# EasyEDA Pro project MAX5864_REUSE.eprj, board PCB3_1
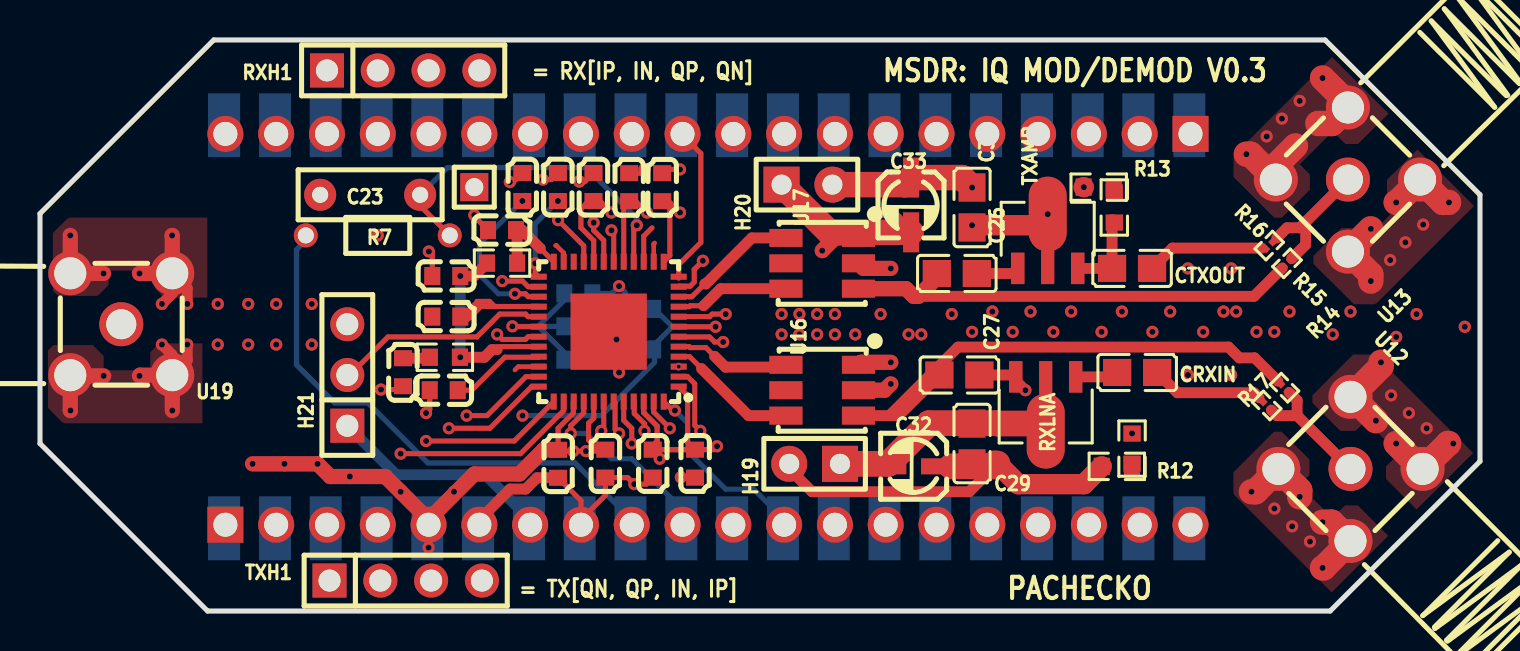
[diagram p12: board, top side]
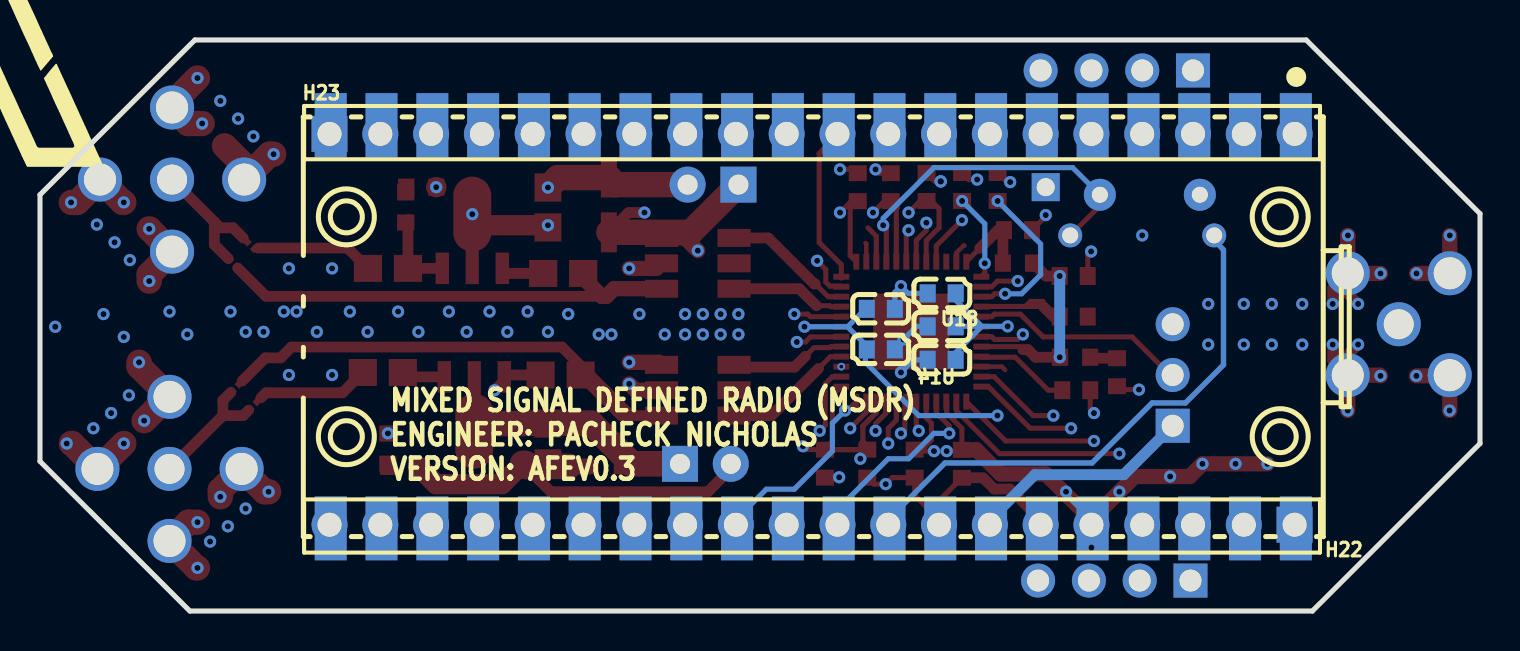
[diagram p13: board, bottom side, seen from below]

Outline 72.01 x 28.58 mm; copper layers: Top Layer, GND, Inner1, Inner2, 3.3, Bottom Layer. Coordinates in mm from the lower left corner of the outline.
Outline path: 0,19.89 0,8.38 8.38,0 64.52,0 72.01,7.49 72.01,20.83 64.26,28.58 8.69,28.58 0,19.89
Stack: Top Layer 0.035mm 外层铜厚1oz / Dielectric1 0.0994mm 3313 RC57% 4.2mil / GND 0.0152mm 内层铜厚 / Dielectric2 0.55mm 0.55mm H/H不含铜 / Inner1 0.0152mm 内层铜厚 / Dielectric3 0.1088mm 2116 RC54% 4.9mil / Inner2 0.0152mm 内层铜厚 / Dielectric4 0.55mm 0.55mm H/H不含铜 / 3.3 0.0152mm 内层铜厚 / Dielectric5 0.0994mm 3313 RC57% 4.2mil / Bottom Layer 0.035mm 外层铜厚1oz

## Design rules (mm)
net RXQN: RXQ
net RXQP: RXQ
net RXIN: RXI
net RXIP: RXI
net TXQN: TXQ
net TXQP: TXQ
net TXIN: TXI
net TXIP: TXI
net RXP: RX
net RXN: RX
net TXP: TX
net TXN: TX
template: Custom Config
spacing copperThickness1oz (default): track to track 0.102, other pairs 0.152 to 0.3
spacing copperThickness2oz: track to track 0.203, other pairs 0.152 to 0.3
track width copperThickness1oz (default): min 0.127, default 0.254, max 2.54
track width copperThickness2oz: min 0.203, default 0.254, max 2.54
differential pair differentialPair (default): width min 0.127, default 0.254, max 2.54; gap min 0.152, default 0.152
via viaSize (default): diameter min 0.356, default 0.61, max 10; hole min 0.198, default 0.305, max 6.3
region e1572 uses copperRegion, innerPlane

## Placement (name value [footprint] x y rotation side)
C18  100nF  [C0603]  20.19 11.05 0 top
C19  100nF  [C0603]  20.32 14.73 0 top
C20  100pF  [C0603]  23.11 19.06 0 top
C21  2200pF  [C0603]  18.15 11.95 90 top
C22  68pF  [C0603]  20.32 16.76 0 top
C23  470nF  [CAP-TH_L7.2-W2.5-P5.00-D0.5]  16.51 20.83 0 top
C26  22nF  [C0805]  45.85 16.89 0 top
C27  22nF  [C0805]  45.97 11.81 0 top
C29  100nF  [C0805]  46.61 8.38 90 top
C31  100nF  [C0805]  46.61 20.19 270 top
C32  100uF  [CAP-SMD_BD3.0-L3.3-W3.3-RD]  43.69 7.24 0 top
C33  100uF  [CAP-SMD_BD3.0-L3.3-W3.3-RD]  43.56 20.32 90 top
CLNA  100pF  [C0603]  32.76 7.38 270 top
CPA  100nF  [C0603]  31.11 21.21 90 top
CPA1  10uF  [C0603]  29.96 15.12 180 bottom
CPA2  10uF  [C0603]  29.96 13.09 180 bottom
CPLL  100pF  [C0603]  27.68 21.22 90 top
CRXIN  22nF  [C0805]  54.86 11.94 0 top
CRXMX  100pF  [C0603]  30.64 7.38 270 top
CTXMX  100pF  [C0603]  29.46 21.21 90 top
CTXOUT  22nF  [C0805]  54.61 17.15 0 top
CVCCCP  10nF  [C0603]  25.9 21.22 90 top
CVCO0  100pF  [C0603]  26.92 15.9 0 bottom
CVCO1  100pF  [C0603]  26.92 14.25 0 bottom
CVCO2  100pF  [C0603]  26.92 12.57 0 bottom
CVRXA  100pF  [C0603]  25.91 7.37 270 top
CVRXF  100pF  [C0603]  28.27 7.38 270 top
CVXTAL  100pF  [C0603]  24.12 21.22 90 top
H12  -  [HDR-TH_1P-V-M_XKB_X4611WV-01I-C28D40]  21.72 21.21 180 top
H19  -  [HDR-TH_2P-P2.54-V-M-1]  38.73 7.37 180 top
H20  -  [HDR-TH_2P-P2.54-V-M-1]  38.35 21.34 0 top
H21  -  [HDR-TH_3P-P2.54-V-M]  15.37 11.81 90 top
H22  -  [HDR-TH_20P-P2.54-V-M-1]  33.4 4.32 0 bottom
H23  -  [HDR-TH_20P-P2.54-V-M-1]  33.4 23.88 180 bottom
R5  1.2k  [R0603]  20.25 12.7 0 top
R6  750  [R0603]  23.11 17.41 180 top
R7  10kΩ  [RES-TH_BD1.8-L3.2-P7.20-D0.4]  16.89 18.8 0 top
R10  10K  [R0603]  54.61 8.13 270 top
R11  10K  [R0603]  53.72 20.19 90 top
R12  150 @ 12v  [R0603]  53.85 7.24 180 top
R13  150 @ 12v  [R0603]  52.94 21.21 180 top
R14  10K  [R0201]  62.23 11.18 135 top
R15  10K  [R0201]  62.36 17.4 225 top
R16  10K  [R0201]  61.47 18.29 225 top
R17  10K  [R0201]  61.34 10.29 135 top
RXH1  -  [HDR-TH_4P-P2.54-V-M]  18.16 27.05 0 top
RXLNA  GALI-S66+  [SOT-89-3_L4.5-W2.5-P1.50-LS4.2-BR]  50.29 10.36 90 top
TXAMP  GALI-52+  [SOT-89-3_L4.5-W2.5-P1.50-LS4.2-BR]  50.39 18.5 270 top
TXH1  -  [HDR-TH_4P-P2.54-V-M]  18.29 1.52 0 top
U12  MCX5.08-H5  [SMA-TH_MCX5.08-H5]  65.53 7.11 315 top
U13  MCX5.08-H5  [SMA-TH_MCX5.08-H5]  65.41 21.59 45 top
U14  MAX2831ETM+T  [TQFN-48_L7.0-W7.0-P0.50-TL-EP5.6]  28.44 13.98 180 top
U16  TCM2-43X+  [IND-SMD_6P-L4.1-W3.8-P1.27-TL]  39.12 11.05 270 top
U17  TCM2-43X+  [IND-SMD_6P-L4.1-W3.8-P1.27-TL]  39.12 17.4 270 top
U18  PICO  [COMM-SMD_L51.0-W21.0-P2.54_SC0916]  33.66 14.22 0 bottom
U19  MCX5.08-H5  [SMA-TH_MCX5.08-H5]  4.06 14.35 180 top

## Footprints (pads in the part's own frame, mm; a bottom-side part is the same pattern mirrored in y, then rotated)
C0603
  rect 0.8x0.9 smd: 1(-0.7,0) 2(0.7,0)
C0805
  rect 1.41x1.35 smd: 1(-1,0) 2(1,0)
CAP-SMD_BD3.0-L3.3-W3.3-RD
  rect 2x0.8 smd: 1(1.37,0) 2(-1.37,0)
CAP-TH_L7.2-W2.5-P5.00-D0.5
  round 1.6 hole 0.8: 1(-2.5,0) 2(2.5,0)
COMM-SMD_L51.0-W21.0-P2.54_SC0916
  rect 1.6x3.2 smd: 1(-24.445,-10.088) 2(-21.905,-10.088) 3(-19.365,-10.088) 4(-16.825,-10.088) 5(-14.285,-10.088) 6(-11.745,-10.088) 7(-9.205,-10.088) 8(-6.665,-10.088) 9(-4.125,-10.088) 10(-1.585,-10.088) 11(0.955,-10.088) 12(3.495,-10.088) 13(6.035,-10.088) 14(8.575,-10.088) 15(11.115,-10.088) 16(13.655,-10.088) 17(16.195,-10.088) 18(18.735,-10.088) 19(21.275,-10.088) 20(23.815,-10.088) 21(23.815,10.088) 22(21.275,10.088) 23(18.735,10.088) 24(16.195,10.088) 25(13.655,10.088) 26(11.115,10.088) 27(8.575,10.088) 28(6.035,10.088) 29(3.495,10.088) 30(0.955,10.088) 31(-1.585,10.088) 32(-4.125,10.088) 33(-6.665,10.088) 34(-9.205,10.088) 35(-11.745,10.088) 36(-14.285,10.088) 37(-16.825,10.088) 38(-19.365,10.088) 39(-21.905,10.088) 40(-24.445,10.088)
HDR-TH_1P-V-M_XKB_X4611WV-01I-C28D40
  rect 1.4x1.4 hole 0.9: 1(0,0)
HDR-TH_2P-P2.54-V-M-1
  rect 1.8x1.8 hole 1: 1(-1.27,0)
  round 1.8 hole 1: 2(1.27,0)
HDR-TH_3P-P2.54-V-M
  rect 1.7x1.7 hole 1.1: 1(-2.54,0)
  round 1.7 hole 1.1: 2(0,0) 3(2.54,0)
HDR-TH_4P-P2.54-V-M
  rect 1.7x1.7 hole 1.1: 1(-3.81,0)
  round 1.7 hole 1.1: 2(-1.27,0) 3(1.27,0) 4(3.81,0)
HDR-TH_20P-P2.54-V-M-1
  rect 1.8x1.8 hole 1.2: 1(-24.13,0)
  round 1.8 hole 1.2: 2(-21.59,0) 3(-19.05,0) 4(-16.51,0) 5(-13.97,0) 6(-11.43,0) 7(-8.89,0) 8(-6.35,0) 9(-3.81,0) 10(-1.27,0) 11(1.27,0) 12(3.81,0) 13(6.35,0) 14(8.89,0) 15(11.43,0) 16(13.97,0) 17(16.51,0) 18(19.05,0) 19(21.59,0) 20(24.13,0)
IND-SMD_6P-L4.1-W3.8-P1.27-TL
  rect 0.9x1.657 smd: 1(-1.27,1.813) 2(0,1.813) 3(1.27,1.813) 4(1.27,-1.813) 5(0,-1.813) 6(-1.27,-1.813)
R0201
  rect 0.303x0.324 smd: 1(-0.241,0) 2(0.241,0)
R0603
  rect 0.806x0.864 smd: 1(-0.753,0) 2(0.753,0)
RES-TH_BD1.8-L3.2-P7.20-D0.4
  round 1.2 hole 0.8: 1(-3.6,0) 2(3.6,0)
SMA-TH_MCX5.08-H5
  round 2.2 hole 1.6: 1(-2.55,-2.55) 2(-2.55,2.55) 3(2.55,2.55) 4(2.55,-2.55)
  round 2.2 hole 1.5: 5(0,0)
SOT-89-3_L4.5-W2.5-P1.50-LS4.2-BR
  rect 1.575x0.672 smd: 1(1.356,-1.5) 3(1.356,1.5)
  custom 5.377x1.9 smd: 2(-1.356,0)
TQFN-48_L7.0-W7.0-P0.50-TL-EP5.6
  rect 0.8x0.3 smd: 1(-3.5,2.751) 2(-3.5,2.251) 3(-3.5,1.75) 4(-3.5,1.251) 5(-3.5,0.75) 6(-3.5,0.252) 7(-3.5,-0.249) 8(-3.5,-0.75) 9(-3.5,-1.25) 10(-3.5,-1.75) 11(-3.5,-2.249) 12(-3.5,-2.748) 25(3.5,-2.748) 26(3.5,-2.249) 27(3.5,-1.75) 28(3.5,-1.25) 29(3.5,-0.75) 30(3.5,-0.249) 31(3.5,0.252) 32(3.5,0.75) 33(3.5,1.251) 34(3.5,1.75) 35(3.5,2.251) 36(3.5,2.751)
  rect 0.3x0.8 smd: 13(-2.751,-3.5) 14(-2.251,-3.5) 15(-1.75,-3.5) 16(-1.25,-3.5) 17(-0.75,-3.5) 18(-0.251,-3.5) 19(0.249,-3.5) 20(0.75,-3.5) 21(1.25,-3.5) 22(1.75,-3.5) 23(2.251,-3.5) 24(2.751,-3.5) 37(2.751,3.5) 38(2.251,3.5) 39(1.75,3.5) 40(1.25,3.5) 41(0.75,3.5) 42(0.251,3.5) 43(-0.251,3.5) 44(-0.75,3.5) 45(-1.25,3.5) 46(-1.75,3.5) 47(-2.251,3.5) 48(-2.751,3.5)
  rect 3.81x3.81 smd: 49(0,0.001)

## Nets
GND: C18.1 C20.1 C21.1 C22.1 C23.1 C29.2 C31.2 C32.2 C33.2 CLNA.2 CPA.2 CPA1.2 CPA2.2 CPLL.2 CRXMX.2 CTXMX.2 CVCCCP.2 CVCO0.2 CVCO1.2 CVCO2.2 CVRXA.2 CVRXF.2 CVXTAL.2 H19.1 H20.1 H22.3 H22.6 H22.8 H22.13 H22.18 H23.3 H23.8 H23.13 H23.18 RXLNA.2 TXAMP.2 U12.1 U12.2 U12.3 U12.4 U13.1 U13.2 U13.3 U13.4 U14.2 U14.26 U14.31 U14.47 U16.1 U16.2 U17.1 U17.2 U18.3 U18.8 U18.13 U18.18 U18.23 U18.28 U18.33 U18.35 U18.38 U19.1 U19.2 U19.3 U19.4
VCC: C29.1 C32.1 H19.2 R12.2
VCC2: C31.1 C33.1 H20.2 R13.2
3.3: CLNA.1 CPA.1 CPA1.1 CPA2.1 CPLL.1 CRXMX.1 CTXMX.1 CVCCCP.1 CVCO0.1 CVCO1.1 CVCO2.1 CVRXA.1 CVRXF.1 CVXTAL.1 H22.5 U14.1 U14.7 U14.13 U14.17 U14.20 U14.25 U14.27 U14.30 U14.39 U14.41 U14.46 U18.36
BYPASS: C18.2 U14.33
CLK: H21.1 H22.7 U18.34
CPOUT: C20.2 R6.1 U14.24
CS#: H22.19 U14.15 U18.22
CTUNE: H21.2 U14.29
D1: U14.23
D2: U14.11
D3: U14.8
D4: U14.34
D5: U14.14
D6: U14.3
D7: U14.6
DIN: H22.16 U14.19 U18.25
PLL_LOCK: H23.14 U14.22 U18.7
RSSI: C23.2 R7.2 U14.16
RXHP: H22.10 U14.40 U18.31
RXIN: RXH1.2 U14.37
RXIP: RXH1.1 U14.38
RXN: U14.5 U16.6
RXP: U14.4 U16.4
RXQN: RXH1.4 U14.35
RXQP: RXH1.3 U14.36
RXTX_MODE: H22.12 U14.48 U18.29
SCLK: H22.17 U14.18 U18.24
SHDN#: H23.11 U14.12 U18.10
TUNE: C22.2 R5.2 R6.2 U14.32
TXIN: TXH1.3 U14.44
TXIP: TXH1.4 U14.45
TXN: U14.10 U17.6
TXP: U14.9 U17.4
TXQN: TXH1.1 U14.42
TXQP: TXH1.2 U14.43
XTAL: C19.2 U14.28
XTAL_IN: C19.1 H21.3 U19.5
$1N1511: H12.1 U14.21
$1N2412: H23.1 U18.20
$1N2414: H23.2 U18.19
$1N2418: H23.4 U18.17
$1N2420: H23.5 U18.16
$1N2434: H23.12 U18.9
$1N2444: H23.17 U18.4
$1N2448: H23.19 U18.2
$1N3367: C21.2 R5.1
$1N4636: H22.2 U18.39
$1N5241: H22.9 R7.1 U18.32
$1N12697: C26.1 R15.2 U17.3
$1N12710: C26.2 TXAMP.1
$1N12721: CTXOUT.1 R11.1 TXAMP.3
$1N12761: C27.1 R14.2 U16.3
$1N12820: R10.2 R12.1
$1N12851: R11.2 R13.1
$1N13115: C27.2 R10.1 RXLNA.3
$1N13128: CRXIN.1 RXLNA.1
$1N13355: R14.1 R17.1 U12.5
$1N13417: CRXIN.2 R17.2
$1N13419: CTXOUT.2 R16.2
$1N13420: R15.1 R16.1 U13.5
$1N14592: H23.20 U18.1
$1N14693: H22.1 U18.40
$1N14747: H22.4 U18.37
$1N14756: H23.9 U18.12
$1N14761: H22.14 U18.27
$1N14771: H23.10 U18.11
$1N14785: H23.7 U18.14
$1N14802: H23.6 U18.15
$1N14812: H23.15 U18.6
$1N14844: H23.16 U18.5
$1N19203: H22.11 U18.30
$1N19205: H22.15 U18.26
$1N19207: H22.20 U18.21

Pads without a net: U14 49; U16 5; U17 5

## Via types
v1: diameter 0.61, hole 0.305, Top Layer to Bottom Layer, 156 vias
v2: diameter 0.381, hole 0.203, Top Layer to Bottom Layer, 1 via

## Routing (per net, layer and track width the routed paths; a pad name or vN(x,y) marks a point on that pad's centre or on a via; arc(x,y) is an arc through that point)
GND: length 124.7
  Top Layer w0.254: v1(26.97,21.5) 27.26,21.5 CPLL.2 ; CPA.2 31.3,22.1 v1(32,22.1) ; v1(19.3,9.91) 19.49,10.09 19.49,11.05 ; C21.1 17.98,11.08 v1(17.05,11.08) ; v1(30.23,22.1) 30.04,21.91 CTXMX.2 ; v1(19.45,17.99) 19.62,17.82 C22.1 ; C20.1 21.72,19.75 v1(21.72,19.81) ; v1(33.02,9.02) 32.74,9.3 32.74,11.37 32.38,11.73 U14.2 ; v1(32.05,6.7) 32.74,6.7 CLNA.2 ; v1(23.5,21.46) 23.67,21.46 CVXTAL.2 ; v1(22.86,13.84) 23.11,13.59 24.27,13.59 24.41,13.73 U14.31 ; U14.47 30.69,9.95 v1(31.5,9.14) ; CVCCCP.2 25.57,21.59 v1(25.15,21.59) ; U14.26 24.41,16.23 24.13,16.51 v1(23.11,16.51) ; CRXMX.2 30.32,6.35 v1(29.72,6.35) 29.39,6.68 CVRXF.2 28.27,5.79 27.05,4.57 27.05,5.52 CVRXA.2
  Top Layer w0.541: v1(6.1,15.37) 6.61,15.89 U19.1 7.37,16.15 v1(7.37,15.37) ; v1(6.1,13.34) 6.61,12.82 U19.2 7.37,12.55 v1(7.37,13.34) ; CVRXA.2 24.85,6.67 24.29,6.1 23.5,6.1 21.97,4.57 ; C33.2 42.57,19.94 v1(41.78,19.94)
  Top Layer w0.762: 40.93,18.67 39.75,18.67 v1(39.12,18.03) ; v1(4.97,16.89) 6.6,16.89 U19.1 6.61,18.79 v1(6.6,18.8) ; v1(42.55,17.15) 41.18,17.15 U17.2 ; v1(3.18,16.89) 1.52,16.89 U19.4 1.51,16.9 v1(1.51,18.8) ; v1(6.62,10.03) 6.62,11.8 U19.2 5.01,11.8 v1(4.97,11.77) ; U16.2 42.23,11.05 v1(42.55,11.37) ; v1(1.52,10.03) 1.51,10.04 U19.3 1.55,11.77 v1(3.18,11.77) ; U16.1 41.06,12.45 v1(42.55,12.45)
  Top Layer w1.016: v1(46.61,19.3) 49.84,19.3 v1(50.39,19.86)
  Top Layer w1.27: v1(67.82,8.38) 69.09,7.11 U12.3 70.41,8.38 70.44,8.38 ; v1(64.14,26.67) 65.41,25.4 U13.3 64.61,24.4 v1(63.9,24.4) ; 70.44,20.45 70.15,20.45 U13.4 67.87,20.45 v1(67.82,20.45) ; 62.78,23.28 61.8,22.29 U13.2 60.53,22.86 v1(60.33,22.86) ; v1(66.55,16.51) 66.55,16.84 U13.1 65.41,17.98 v1(66.55,19.12) ; 37.08,21.34 39.47,18.95 C33.2 ; v1(64.14,4.45) 64.59,4.45 U12.4 64.19,2.16 v1(64.14,2.16) ; v1(66.8,9.53) 65.61,10.72 U12.2 67.06,12.24 v1(67.06,12.45) ; v1(62.99,5.72) 62.99,6.05 U12.1 60.78,5.97 v1(60.58,5.97)
  Top Layer w1.282: H19.1 42.42,7.37 44.45,9.4 47.86,9.4 47.88,9.38 49.91,9.38 50.29,9
  Inner1 w0.254: v1(19.45,17.99) 18.64,18.8 v1(16.89,18.8)
  Bottom Layer w0.254: 27.62,12.57 28.32,12.57 v1(28.96,11.94) ; CVCO1.2 28.17,14.25 v1(28.83,13.59) 29.26,13.16 CPA2.2 ; CVCO0.2 28.6,15.9 v1(28.96,16.26) 29.26,15.95 CPA1.2
  vias: v1(8.89,15.37) v1(8.89,13.34) v1(10.41,15.37) v1(10.41,13.34) v1(11.81,15.37) v1(11.81,13.34) v1(13.59,15.37) v1(13.59,13.34) v1(37.08,14.86) v1(37.08,13.84) v1(37.97,14.86) v1(37.97,13.84) v1(38.86,14.86) v1(38.86,13.84) v1(39.75,14.86) v1(39.75,13.84) v1(40.77,13.84) v1(42.04,14.86) v1(43.43,13.84) v1(44.07,13.84) v1(45.59,14.86) v1(46.61,13.97) v1(47.63,14.99) v1(48.64,13.97) v1(49.53,14.99) v1(50.67,13.97) v1(51.56,14.99) v1(53.09,13.97) v1(54.1,14.99) v1(55.63,13.97) v1(56.52,14.99) v1(57.4,17.15) v1(57.4,11.81) v1(58.17,13.97) v1(59.18,14.99) v1(59.56,17.15) v1(59.56,11.81) v1(59.82,14.99) v1(60.83,13.97) v1(61.34,23.75) v1(61.72,13.97) v1(61.73,5.13) v1(62.1,24.64) v1(62.48,14.99) v1(62.61,4.24) v1(62.99,25.53) v1(63.5,3.48) v1(64.64,13.84) v1(65.53,14.99) v1(67.52,17.56) v1(67.56,10.8) v1(67.82,13.72) v1(68.28,18.45) v1(68.45,9.91) v1(68.83,14.86) v1(69.17,19.34) v1(69.34,9.14) v1(70.46,20.45) v1(70.67,8.38) v1(71.25,14.22)
VCC: length 20
  Top Layer w0.541: 47.74,7.24 46.47,5.97 38.61,5.97 37.47,7.11 H19.2
  Top Layer w1.016: R12.2 52.21,6.35 48.91,6.35 47.88,7.38
  Top Layer w1.282: 45.57,7.24 47.74,7.24 47.74,7.38 47.88,7.38
VCC2: length 12.9
  Top Layer w1.016: v1(52.2,21.21) R13.2
  Top Layer w1.27: v1(46.61,21.19) 46.11,21.69 C33.1 43.21,21.34 H20.2
  Inner2 w1.016: v1(52.2,21.21) 46.63,21.21 v1(46.61,21.19)
3.3: length 89
  Top Layer w0.254: U14.25 24.77,16.9 v1(24.77,17.4) ; v1(33.86,8.25) 33.69,8.08 CLNA.1 32.39,8.45 32.39,10.78 U14.1 ; v1(33.78,14.22) 31.94,14.22 U14.7 ; v1(30.35,19.94) 29.78,20.51 CTXMX.1 29.19,20.23 U14.17 ; CRXMX.1 30.64,7.97 v1(30.99,7.62) ; v1(23.62,14.25) 23.64,14.23 U14.30 ; v1(28.58,19.94) 28.01,20.51 27.69,20.51 CPLL.1 27.43,20.52 27.05,20.14 27.05,19.18 27.69,18.54 U14.20 ; U14.39 26.67,10.46 26.67,9.91 25.91,9.14 CVRXA.1 25.97,8 v1(26.67,8) v1(27.3,8) 28.2,8 CVRXF.1 27.91,8.08 27.43,8.55 27.43,9.4 27.69,9.66 U14.41 ; U14.13 31.5,17.79 31.5,20.13 CPA.1 31.43,20.51 v1(32,19.94) ; v1(23.75,15.88) 24.27,15.88 24.42,15.73 U14.27
  Top Layer w0.267: U14.46 30.19,9.93 30.86,9.26 30.86,8.49 30.61,8.24 30.77,8.08 CLNA.1
  Top Layer w0.381: 19.43,4.57 v1(19.43,3.18)
  Top Layer w0.762: v1(10.63,7.37) v1(12.22,7.37) v1(13.88,7.37) 14.51,6.73 v1(15.49,6.73) 17.27,6.73 v1(18.03,5.97) 19.43,4.57 21.72,6.86 23.98,6.86 25.2,8.08 25.21,8.07 CVRXA.1
  Bottom Layer w0.254: v1(24.77,17.4) 24.77,19.38 v1(25.9,20.52) ; 26.22,14.25 24.91,14.25 ; 24.91,14.25 26.22,15.55 26.22,15.9 ; 24.91,14.25 26.22,12.93 CVCO2.1 ; 24.91,14.25 v1(23.62,14.25) ; v1(24.12,20.52) 21.97,18.37 21.97,16.83 22.92,15.88 v1(23.75,15.88) ; 19.43,4.57 20.7,5.84 v1(20.7,5.97) ; v1(24.13,9.78) 28.07,9.78 30.73,12.45 30.73,13.02 CPA2.1 30.66,13.26 31.62,14.22 ; v1(33.78,14.22) 31.62,14.22 ; 31.62,14.22 30.73,15.12 CPA1.1
BYPASS: length 4.7
  Top Layer w0.254: C18.2 21.59,11.05 23.24,12.7 24.91,12.7 U14.33
CLK: length 11.1
  Bottom Layer w0.541: 24.51,4.57 22.26,6.82 17.81,6.82 H21.1
CPOUT: length 4.2
  Top Layer w0.254: U14.24 25.02,18.15
  Top Layer w0.541: 25.02,18.15 24.11,19.06 C20.2 23.86,19.01 R6.1
CS#: length 32.3
  Top Layer w0.254: U14.15 30.19,18.76 30.61,19.18
  Inner2 w0.254: 30.61,19.18 39.62,19.18 54.23,4.57 54.99,4.57
CTUNE: length 10.9
  Top Layer w0.254: U14.29 24.41,14.73 24.28,14.86 22.99,14.86 21.84,13.72 17.4,13.72 15.37,11.68
D1: length 1
  Top Layer w0.229: U14.23 26.19,17.92 25.82,18.29 25.78,18.29
D2: length 2.1
  Top Layer w0.254: U14.11 31.97,16.26 32.51,16.26 32.72,16.46 32.72,17.09 v1(33.15,17.53)
D3: length 2.4
  Top Layer w0.254: U14.8 33.49,14.73 33.62,14.86 v1(34.29,14.86)
D4: length 1.3
  Top Layer w0.229: 23.75,12.07 23.91,12.23 U14.34
D5: length 1
  Top Layer w0.229: 30.73,18.42 30.69,18.37 U14.14
D6:
  vias: v2(31.94,12.23)
D7: length 2.3
  Top Layer w0.254: v1(34.16,13.46) 33.73,13.46 33.48,13.72 31.95,13.72 U14.6
DIN: length 30.8
  Top Layer w0.254: v1(27.69,19.43) 27.69,19.05 28.19,18.55 U14.19
  Inner2 w0.254: v1(27.69,19.43) 27.69,15.62 33.4,9.91 42.93,9.91 47.37,5.46 47.37,4.57
PLL_LOCK: length 5.2
  Inner1 w0.229: 25.27,19.05 25.27,20.45 24.38,21.34 24.38,23.75 H23.14
RSSI: length 17.5
  Top Layer w0.254: v1(29.85,19.3) 29.69,19.15 U14.16 ; C23.2 19.01,20.28 20.62,18.67
  Bottom Layer w0.254: v1(29.85,19.3) 29.85,19.65 27.31,22.19 20.37,22.19 C23.2
RXHP: length 9.5
  Top Layer w0.254: v1(26.54,8.89) 26.54,9.27 27.19,9.92 U14.40
  Bottom Layer w0.254: v1(26.54,8.89) 27.3,8.89 28.58,7.62 29.59,7.62 32.13,5.08 32.13,4.57
RXIN: length 27.8
  Top Layer w0.254: U14.37 23.72,8.51 v1(19.3,8.51)
  Inner2 w0.267: RXH1.2 16.89,25.78 15.62,24.51 15.62,18.03 17.29,16.36 17.29,11.79 17.64,11.44 17.64,10.17 v1(19.3,8.51)
RXIP: length 33.8
  Top Layer w0.254: U14.38 26.19,10.03 24.03,7.87 v1(18.03,7.87)
  Inner2 w0.267: RXH1.1 14.35,25.91 13.08,24.64 13.08,21.97 12.41,21.3 12.41,10.13 14.66,7.87 v1(18.03,7.87)
RXN: length 5.8
  Top Layer w0.254: 33.73,12.75 33.3,13.18 32.51,13.18 32.47,13.23 U14.5
  Top Layer w0.541: U16.6 37.19,12.21 34.28,12.21 33.73,12.75
RXP: length 6.6
  Top Layer w0.254: 33.08,12.14 32.48,12.73 U14.4
  Top Layer w0.541: 33.08,12.14 35.43,9.78 U16.4
RXQN: length 24.2
  Top Layer w0.254: v1(21.34,9.78) 22.35,9.78 24.3,11.73 U14.35
  Inner2 w0.267: RXH1.4 20.7,25.78 20.7,20.57 18.67,18.54 18.67,12.32 21.21,9.78 v1(21.34,9.78)
RXQP: length 25
  Top Layer w0.254: v1(20.45,9.14) 22.5,9.14 24.58,11.23 U14.36
  Inner2 w0.267: RXH1.3 18.16,25.78 18.16,23.11 17.89,22.85 17.89,12.2 20.45,9.65 v1(20.45,9.14)
RXTX_MODE: length 9.3
  Top Layer w0.254: U14.48 31.64,10.03 v1(31.75,10.03)
  Bottom Layer w0.254: 37.21,4.57 35.69,6.1 34.29,6.1 32.39,8 32.39,9.4 v1(31.75,10.03)
SCLK: length 29.8
  Top Layer w0.254: U14.18 28.69,18.94 v1(28.58,19.05)
  Inner2 w0.254: 49.91,4.57 49.91,5.97 38.99,16.89 30.73,16.89 v1(28.58,19.05)
SHDN#: length 8.1
  Top Layer w0.254: H23.11 32.13,23.81 33.05,22.9 33.05,18.44 31.94,17.33 U14.12 31.94,16.66
TUNE: length 9.8
  Top Layer w0.254: v1(21.02,12.7) R5.2 ; U14.32 23.01,13.23 22.86,13.08
  Top Layer w0.541: v1(21.02,16.76) 21.71,16.76 R6.2
  Top Layer w0.543: v1(21.02,12.7) 22.23,12.7 22.61,13.08 22.86,13.08
  Bottom Layer w0.541: v1(21.02,16.76) v1(21.02,12.7)
TXIN: length 16.5
  Top Layer w0.254: U14.44 29.19,9.55 29.59,9.14 v1(29.59,8.38)
  Inner1 w0.254: 19.56,1.91 20.7,3.05 20.7,5.08 21.84,6.22 27.94,6.22 29.59,7.87 v1(29.59,8.38)
TXIP: length 14.6
  Top Layer w0.254: v1(30.23,9.02) 30.23,9.38 29.72,9.88 29.72,10.45 U14.45
  Inner1 w0.254: 22.1,1.91 23.24,3.05 23.24,4.9 24.04,5.7 28.18,5.7 30.23,7.75 v1(30.23,9.02)
TXN: length 6.6
  Top Layer w0.254: U14.10 32.47,15.73 32.47,15.73 32.6,15.73 33.24,16.37
  Top Layer w0.541: 33.24,16.37 33.3,16.37 35.6,18.67 37.3,18.67
TXP: length 5.7
  Top Layer w0.254: 33.18,15.28 32.51,15.28 32.47,15.23 U14.9
  Top Layer w0.541: U17.4 34.04,16.13 33.18,15.28
TXQN: length 19.9
  Top Layer w0.254: U14.42 28.19,9.14 v1(28.07,9.02)
  Inner1 w0.254: 14.48,1.91 14.48,2.03 15.62,3.18 15.62,5.08 17.78,7.24 27.37,7.24 28.07,7.94 v1(28.07,9.02)
TXQP: length 18.3
  Top Layer w0.254: U14.43 28.76,10.41 28.76,9.09 v1(28.96,8.89)
  Inner1 w0.254: 16.89,1.91 18.16,3.18 18.16,5.08 19.81,6.73 27.69,6.73 28.86,7.91 28.86,8.8 v1(28.96,8.89)
XTAL: length 5.1
  Top Layer w0.254: U14.28 24.93,15.24 22.73,15.24 ; 22.73,15.24 22.48,15.49 21.84,15.49 ; 22.73,15.24 21.84,15.24 ; C19.2 21.34,14.73
  Top Layer w0.541: 21.34,14.73 21.84,15.24
$1N1511: length 7.5
  Top Layer w0.254: U14.21 27.19,18.28 v1(25.91,19.56)
  Inner2 w0.254: H12.1 23.37,19.56 v1(25.91,19.56)
$1N3367: length 1.4
  Top Layer w0.541: C21.2 19.44,12.65 R5.1
$1N5241: length 26.6
  Bottom Layer w0.267: 29.59,4.57 26.75,7.41 19.4,7.41 16.4,10.41 14.73,10.41 12.83,12.32 12.83,18.08 13.42,18.67
$1N12697: length 23.5
  Top Layer w0.541: 62.12,17.16 60.71,15.75 43.92,15.75
  Top Layer w0.762: U17.3 43.31,16.13 43.69,15.75 43.92,15.75 44.85,16.67 C26.1
$1N12710: length 2.2
  Top Layer w0.541: TXAMP.1 48.64,16.89 C26.2
$1N12721: length 4.2
  Top Layer w0.541: 53.61,19.58 CTXOUT.1 TXAMP.3
$1N12761: length 26.7
  Top Layer w0.254: R14.2 61.9,11.51
  Top Layer w0.541: 61.9,11.51 60.74,12.67 59.98,12.67 59.44,13.21 45.91,13.21 42.48,9.78 ; 44.97,11.83 C27.1 42.94,9.78 42.48,9.78 ; U16.3 42.48,9.78
$1N13115: length 9
  Top Layer w0.533: v1(49.28,11.05) 48.79,11.53 RXLNA.3
  Top Layer w0.541: C27.2 48.7,11.81 RXLNA.3
  Inner1 w1.016: v1(49.28,11.05) 51.44,8.89 v1(54.61,8.89)
$1N13128: length 2.2
  Top Layer w0.541: RXLNA.1 53.64,11.72 CRXIN.1
$1N13355: length 6.5
  Top Layer w0.541: 62.47,10.94 62.86,10.54 62.86,9.78 ; U12.5 62.86,9.78 ; 62.86,9.78 61.85,9.78 61.58,10.05
$1N13417: length 5.6
  Top Layer w0.541: 60.96,10.67 60.71,10.92 56.88,10.92 CRXIN.2
$1N13419: length 5.9
  Top Layer w0.541: CTXOUT.2 56.63,18.16 61.09,18.16
$1N13420: length 6.9
  Top Layer w0.541: 63.29,19.48 63.29,18.33 62.59,17.63 ; 63.29,19.48 62.99,19.18 62.36,19.18 61.85,18.67 ; 63.29,19.48 U13.5

## Copper pours and planes (outline as drawn; the poured copper is in the pictures)
GND on Top Layer: 59.69,27.72 67.44,27.72 67.44,19.69 59.69,19.69
GND on Top Layer: 0.64,19.69 8.37,19.69 8.37,15.69 0.64,15.69
GND on Top Layer: 63.63,12.83 71.66,12.83 71.66,5.08 63.63,5.08
GND on Top Layer: 59.67,8.97 67.42,8.97 67.42,0.93 59.67,0.93
GND on Top Layer: 63.67,23.1 71.71,23.1 71.71,15.35 63.67,15.35
GND on Top Layer: 0.4,13.4 8.12,13.4 8.12,9.39 0.4,9.39
GND on GND: 61.8,8.2 63.02,8.2 63.02,6.98 61.8,6.98
GND on GND: 61.67,21.72 62.89,21.72 62.89,20.5 61.67,20.5
GND on GND: 60.83,8.2 62.06,8.2 62.06,6.98 60.83,6.98
GND on GND: 61.67,22.68 62.89,22.68 62.89,21.46 61.67,21.46
GND on GND: 65.27,25.33 66.5,25.33 66.5,24.11 65.27,24.11
GND on GND: 65.28,18.11 66.5,18.11 66.5,16.89 65.28,16.89
GND on GND: 67.92,22.68 69.14,22.68 69.14,21.46 67.92,21.46
GND on GND: 65.4,3.63 66.62,3.63 66.62,2.41 65.4,2.41
GND on GND: 64.31,25.33 65.53,25.33 65.53,24.11 64.31,24.11
GND on GND: 64.44,11.81 65.66,11.81 65.66,10.59 64.44,10.59
GND on GND: 68.05,8.2 69.27,8.2 69.27,6.98 68.05,6.98
GND on GND: 61.8,7.24 63.02,7.24 63.02,6.02 61.8,6.02
GND on GND: 64.31,19.07 65.54,19.07 65.54,17.85 64.31,17.85
GND on GND: 64.44,10.85 65.66,10.85 65.66,9.63 64.44,9.63
GND on GND: 69.01,8.2 70.23,8.2 70.23,6.98 69.01,6.98
GND on GND: 65.4,10.85 66.62,10.85 66.62,9.63 65.4,9.63
GND on GND: 64.31,26.29 65.53,26.29 65.53,25.07 64.31,25.07
GND on GND: 0.26,28.32 71.75,28.32 71.75,0.26 0.26,0.26
GND on GND: 60.71,21.72 61.93,21.72 61.93,20.5 60.71,20.5
GND on GND: 64.31,18.11 65.53,18.11 65.53,16.89 64.31,16.89
GND on GND: 65.28,19.07 66.5,19.07 66.5,17.85 65.28,17.85
GND on GND: 64.44,3.64 65.66,3.64 65.66,2.41 64.44,2.41
GND on GND: 60.71,22.68 61.93,22.68 61.93,21.46 60.71,21.46
GND on GND: 69.01,7.24 70.23,7.24 70.23,6.02 69.01,6.02
GND on GND: 60.83,7.24 62.05,7.24 62.05,6.02 60.83,6.02
GND on GND: 65.4,4.6 66.62,4.6 66.62,3.38 65.4,3.38
GND on GND: 65.4,11.81 66.62,11.81 66.62,10.59 65.4,10.59
GND on GND: 68.05,7.24 69.27,7.24 69.27,6.02 68.05,6.02
GND on GND: 68.88,21.72 70.1,21.72 70.1,20.5 68.88,20.5
GND on GND: 67.92,21.72 69.14,21.72 69.14,20.5 67.92,20.5
GND on GND: 64.44,4.6 65.66,4.6 65.66,3.38 64.44,3.38
3.3 on 3.3: 0.26,28.32 34.29,28.32 34.29,0.26 0.26,0.26

Small or netless copper shapes (teardrops, artwork), in the pictures only: 62 on GND, 4 on 3.3

## Text on the board
Bottom Silkscreen Layer: MIXED SIGNAL DEFINED RADIO (MSDR) / ENGINEER: PACHECK NICHOLAS / VERSION: AFEV0.3
Top Silkscreen Layer: = TX[QN, QP, IN, IP] | = RX[IP, IN, QP, QN] | MSDR: IQ MOD/DEMOD V0.3 | PACHECKO
